# Altium schematic sheet DC Power Supply (AC adapter - 5V0 - 3V3).SchDoc
size A4
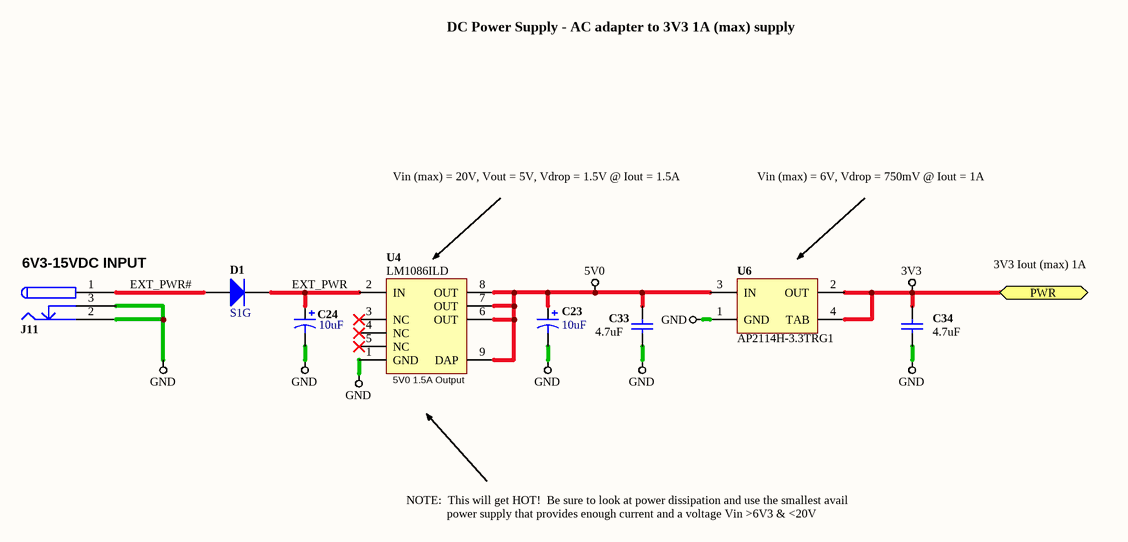
[diagram p0: DC Power Supply (AC adapter - 5V0 - 3V3).SchDoc]

## Parts
C23  Capacitance: 10uF  [AVX-CAPC3528_V]  (hidden comment: TAJB106K020R)
C24  Capacitance: 10uF  [AVX-CAPC3528_V]  (hidden comment: TAJB106K020R)
C33  value 4.7uF  [CAPC0603(1608)55_L]  (hidden comment: CAP 4.7uF 10V 0603(1608))
C34  value 4.7uF  [CAPC0603(1608)55_L]  (hidden comment: CAP 4.7uF 10V 0603(1608))
D1  S1G  [DO-214AC]
J11  PWR CONNECTOR  [KLD-0202]  (value not drawn)
U4  Abbreviated Name: LM1086ILD  [LDC08A]  (hidden comment: LM1086ILD-3.3/NOPB)
U6  AP2114H-3.3TRG1  [SOT230P700X180-4L]

## Ports
PWR

## Nets
3V3: C34.1 U6.2(OUT) U6.4(TAB) ; port PWR
5V0: C23.1 C33.1 U4.6(OUT) U4.7(OUT) U4.8(OUT) U4.9(DAP) U6.3(IN)
GND: C23.2 C24.2 C33.2 C34.2 J11.2 J11.3 U4.1(GND) U6.1(GND)
EXT_PWR: C24.1 D1.2 U4.2(IN)
EXT_PWR#: D1.1 J11.1

Not connected (* = marked no-connect by the designer): U4 3(NC)* 4(NC)* 5(NC)*

## Notes on the sheet
- DC Power Supply - AC adapter to 3V3 1A (max) supply
- Vin (max) = 20V, Vout = 5V, Vdrop = 1.5V @ Iout = 1.5A
- Vin (max) = 6V, Vdrop = 750mV @ Iout = 1A
- (near J11) 6V3-15VDC INPUT
- 3V3 Iout (max) 1A
- (near U4) 5V0 1.5A Output
- NOTE:  This will get HOT!  Be sure to look at power dissipation and use the smallest avail
- power supply that provides enough current and a voltage Vin >6V3 & <20V

## Library data of the parts
C23 C24 = CMP-0279-00001-1: Capacitor, Tantalum, 10uF 10% 20V MCCT-B (3528); Manufacturer: AVX; Polarity: Polarized; PartNumber: TAJB106K020R; PackageDescription: 2-Pin SMT Capacitor, 3.5 x 2.8 mm Body; ComponentLink1URL: http://www.avx.com/; PackageReference: CAPC3528; ComponentLink2Description: Datasheet; Technology: Tantalum; ComponentLink2URL: http://www.avx.com/docs/Catalogs/taj.pdf; Tolerance: 10%; ComponentLink1Description: Manufacturer URL; Rated Voltage: 20V; DatasheetVersion: Jun-13; Mounting Technology: Surface Mount
C33 C34 = CAP 4.7uF 10V ±10% 0603 (1608 Metric) Thickness 0.55mm SMD: Case-Metric: 1608; Case-EIA: 0603; Tolerance: ±10%; Rated Voltage: 10 V; Technology: SMT; Max Thickness: 0.55 mm
D1 = S1G: Fairchild S1G General Purpose Rectifier; Vrrm: 400V; If(AV): 1.0A; Ifsm: 30A; Pd: 1.4W; Trr: 1.8uS; Ct: 6.6pF; Package: DO-214AC
J11 = POWER-CONNECTOR-3: Connector, 3 Conductor Power Jack; Connector type: POWERJACK 3 HEADER; ClassName: PWR_CONN_5V0; Category: Connector; Mounting Technology: PTH; Pin Count: 3
U4 = CMP-0062-01489-2: 1.5A Low Dropout Positive Regulators, 8-pin LLP, Pb-Free; Manufacturer: National Semiconductor; PowerWise: N; CompType: LDO IC; PackageTopMarking: NS*UZXYTT*1086I33; ComponentLink1Description: LM1086 Datasheet; RoHS: Y; ComponentLink2URL: http://www.national.com/pf/LM/LM1086.html; PinCount: 8; DatasheetVersion: Jun-2005; ComponentLink2Description: LM1086 Web Page; ComponentLink3URL: http://www.national.com/packaging/folders/ldc08a.html; ComponentLink1URL: http://www.national.com/ds/LM/LM1086.pdf; PackageReference: LDC08A; PackageVersion: revB, Jun-2003; ComponentLink3Description: LDC08A Package Page; PackageDescription: LLP, Plastic, Dual, 4 x 4 x 0.75mm Body, 8 Lead, 0.8mm Pitch; RevisionNote: Component URLs added
U6 = AP2114H-3.3TRG1: AP2114, 1A Low Dropout Positive Fixed 3V3 Regulator; Max Input Voltage: 6V; Max Output Voltage: 3.34V; Min Input Voltage: -0.3V; Min Output Voltage: 3.25V; Supply Voltage: 5V; Max Output Current: 1A; Mounting Technology: Surface Mount; Status: Unreleased; Temperature Range: -40 - 125 degC; Category: IC-Power